# Altium schematic sheet sensor.schDoc: Sensor Controller
size A4; SheetNumber: 2; SheetTotal: 7
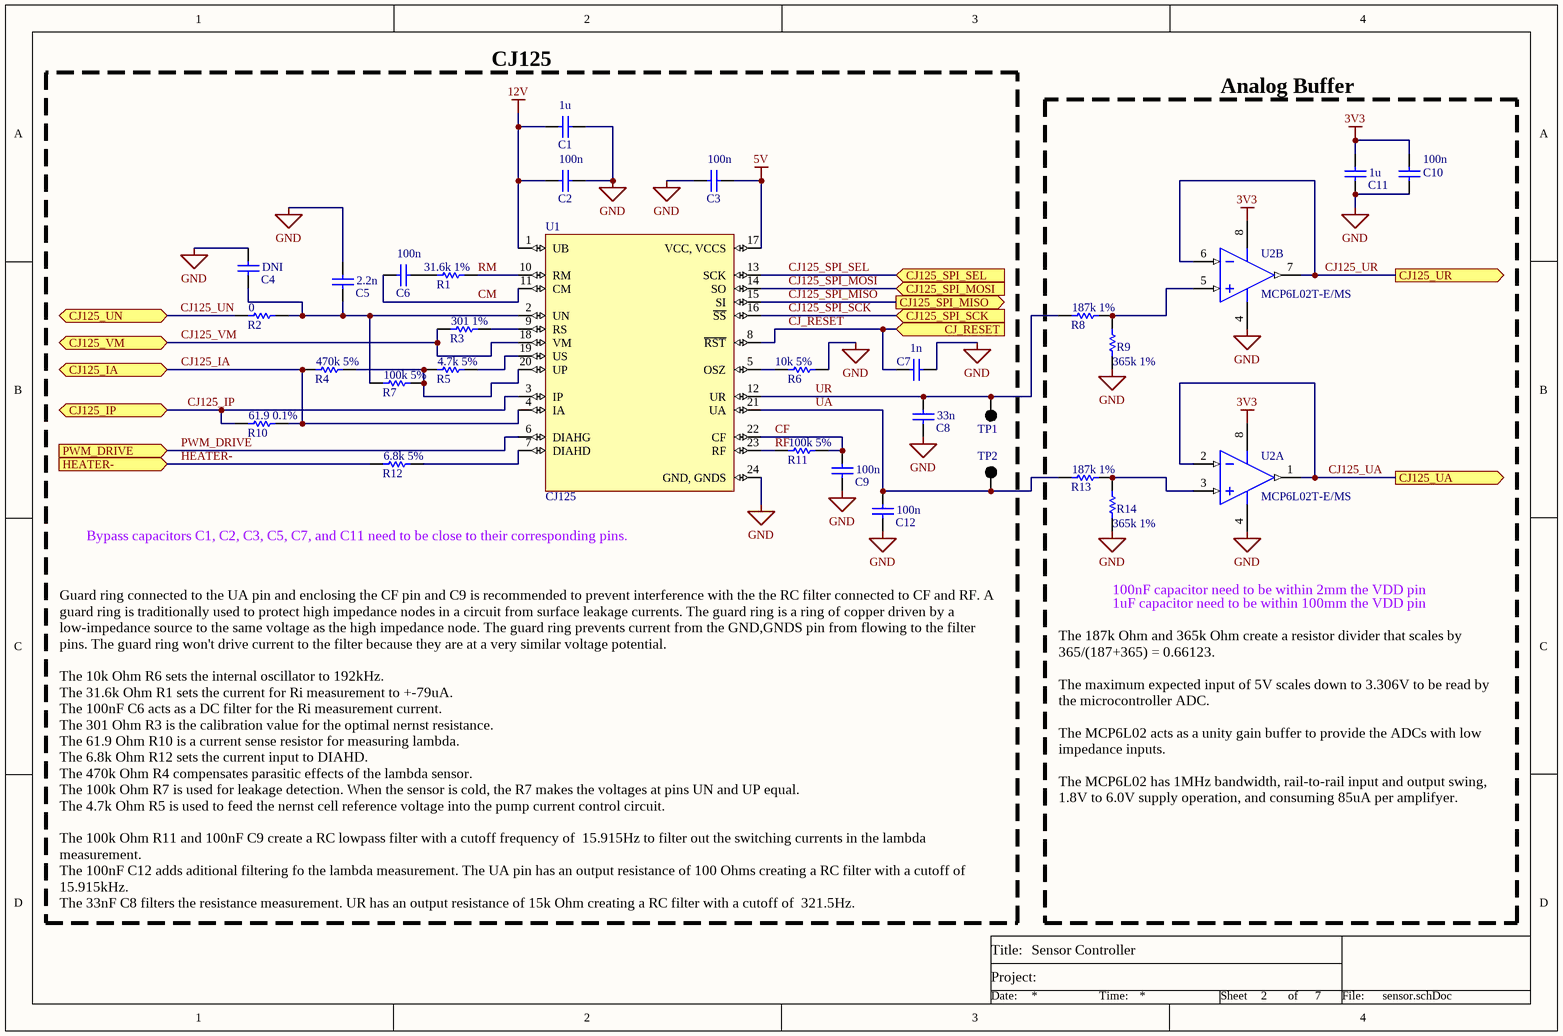
[diagram p0: sensor.schDoc]

## Parts
C1  value 1u  [0805]  (hidden comment: Generic 0805 Capacitor)
C2  value 100n  [0805]  (hidden comment: Generic 0805 Capacitor)
C3  value 100n  [0805]  (hidden comment: Generic 0805 Capacitor)
C4  value DNI  [0805]  (hidden comment: Generic 0805 Capacitor)
C5  value 2.2n  [0805]  (hidden comment: Generic 0805 Capacitor)
C6  value 100n  [0805]  (hidden comment: Generic 0805 Capacitor)
C7  value 1n  [0805]  (hidden comment: Generic 0805 Capacitor)
C8  value 33n  [0805]  (hidden comment: Generic 0805 Capacitor)
C9  value 100n  [0805]  (hidden comment: Generic 0805 Capacitor)
C10  value 100n  [0805]  (hidden comment: Generic 0805 Capacitor)
C11  value 1u  [1206]  (hidden comment: Generic 1206 Capacitor)
C12  value 100n  [0805]  (hidden comment: Generic 0805 Capacitor)
R1  value 31.6k 1%  [0603]  (hidden comment: Generic 0603 Resistor)
R2  value 0  [0603]  (hidden comment: Generic 0603 Resistor)
R3  value 301 1%  [0603]  (hidden comment: Generic 0603 Resistor)
R4  value 470k 5%  [0603]  (hidden comment: Generic 0603 Resistor)
R5  value 4.7k 5%  [0603]  (hidden comment: Generic 0603 Resistor)
R6  value 10k 5%  [0603]  (hidden comment: Generic 0603 Resistor)
R7  value 100k 5%  [0603]  (hidden comment: Generic 0603 Resistor)
R8  value 187k 1%  [0603]  (hidden comment: Generic 0603 Resistor)
R9  value 365k 1%  [0603]  (hidden comment: Generic 0603 Resistor)
R10  value 61.9 0.1%  [0603]  (hidden comment: Generic 0603 Resistor)
R11  value 100k 5%  [0603]  (hidden comment: Generic 0603 Resistor)
R12  value 6.8k 5%  [0603]  (hidden comment: Generic 0603 Resistor)
R13  value 187k 1%  [0603]  (hidden comment: Generic 0603 Resistor)
R14  value 365k 1%  [0603]  (hidden comment: Generic 0603 Resistor)
TP1  5001  [KSTN-5001]  (value not drawn)
TP2  5001  [KSTN-5001]  (value not drawn)
U1  CJ125  [SOIC-24]
U2  MCP6L02T-E/MS  [MSOP8_M]  (parts A,B of 2)

## Blocks framed on the sheet
CJ125: C1-C9 C12 R1-R7 R10-R12 TP1 TP2 U1
Analog Buffer: C10 C11 R8 R9 R13 R14 U2

## Ports
CJ125_IA (bidir), CJ125_IP (bidir), CJ125_SPI_MISO (out), CJ125_SPI_MOSI (in), CJ125_SPI_SCK (in), CJ125_SPI_SEL (in), CJ125_UA (out), CJ125_UN (bidir), CJ125_UR (out), CJ125_VM (bidir), CJ_RESET (in), HEATER- (in), PWM_DRIVE (in)

## Nets
3V3: C10.2 C11.2 U2.8(VDD)
5V: C3.1 U1.17(VCC,_VCCS)
12V: C1.1 C2.2 U1.1(UB)
GND: C1.2 C2.1 C3.2 C4.2 C5.2 C7.2 C8.1 C9.1 C10.1 C11.1 C12.1 R6.2 R9.1 R14.1 U1.24(GND,_GNDS) U2.4(VSS)
CF: C9.2 R11.2 U1.22(CF)
CJ125_IA: R4.1 R10.2 U1.4(IA) ; port CJ125_IA
CJ125_IP: R10.1 U1.3(IP) ; port CJ125_IP
CJ125_SPI_MISO: U1.15(SI) ; port CJ125_SPI_MISO
CJ125_SPI_MOSI: U1.14(SO) ; port CJ125_SPI_MOSI
CJ125_SPI_SCK: U1.16(~{SS}) ; port CJ125_SPI_SCK
CJ125_SPI_SEL: U1.13(SCK) ; port CJ125_SPI_SEL
CJ125_UA: U2.1(VOUTA) U2.2(VINA-) ; port CJ125_UA
CJ125_UN: R2.1 ; port CJ125_UN
CJ125_UR: U2.6(VINB-) U2.7(VOUTB) ; port CJ125_UR
CJ125_VM: R3.1 U1.18(VM) ; port CJ125_VM
CJ_RESET: C7.1 U1.8(~{RST}) ; port CJ_RESET
CM: C6.1 U1.11(CM)
HEATER-: R12.1 ; port HEATER-
PWM_DRIVE: U1.6(DIAHG) ; port PWM_DRIVE
RF: R11.1 U1.23(RF)
RM: R1.2 U1.10(RM)
UA: C12.2 R13.1 TP2.1 U1.21(UA)
UR: C8.2 R8.1 TP1.1 U1.12(UR)
NetC4_1: C4.1 C5.1 R2.2 R7.1 U1.2(UN)
NetC6_2: C6.2 R1.1
NetR3_2: R3.2 U1.9(RS)
NetR4_2: R4.2 R5.1 R7.2 U1.20(UP)
NetR5_2: R5.2 U1.19(US)
NetR6_1: R6.1 U1.5(OSZ)
NetR8_2: R8.2 R9.2 U2.5(VINB+)
NetR12_2: R12.2 U1.7(DIAHD)
NetR13_2: R13.2 R14.2 U2.3(VINA+)

## Notes on the sheet
- Bypass capacitors C1, C2, C3, C5, C7, and C11 need to be close to their corresponding pins.
- 100nF capacitor need to be within 2mm the VDD pin
- 1uF capacitor need to be within 100mm the VDD pin
- Guard ring connected to the UA pin and enclosing the CF pin and C9 is recommended to prevent interference with the the RC filter connected to CF and RF. A guard ring is traditionally used to protect high impedance nodes in a circuit from surface leakage currents. The guard ring is a ring of copper driven by a low-impedance source to the same voltage as the high impedance node. The guard ring prevents current from the GND,GNDS pin from flowing to the filter pins. The guard ring won't drive current to the filter because they are at a very similar voltage potential.
  The 10k Ohm R6 sets the internal oscillator to 192kHz.
  The 31.6k Ohm R1 sets the current for Ri measurement to +-79uA.
  The 100nF C6 acts as a DC filter for the Ri measurement current.
  The 301 Ohm R3 is the calibration value for the optimal nernst resistance.
  The 61.9 Ohm R10 is a current sense resistor for measuring lambda.
  The 6.8k Ohm R12 sets the current input to DIAHD.
  The 470k Ohm R4 compensates parasitic effects of the lambda sensor.
  The 100k Ohm R7 is used for leakage detection. When the sensor is cold, the R7 makes the voltages at pins UN and UP equal.
  The 4.7k Ohm R5 is used to feed the nernst cell reference voltage into the pump current control circuit.
  The 100k Ohm R11 and 100nF C9 create a RC lowpass filter with a cutoff frequency of  15.915Hz to filter out the switching currents in the lambda measurement.
  The 100nF C12 adds aditional filtering fo the lambda measurement. The UA pin has an output resistance of 100 Ohms creating a RC filter with a cutoff of 15.915kHz.
  The 33nF C8 filters the resistance measurement. UR has an output resistance of 15k Ohm creating a RC filter with a cutoff of  321.5Hz.
- The 187k Ohm and 365k Ohm create a resistor divider that scales by 365/(187+365) = 0.66123.
  The maximum expected input of 5V scales down to 3.306V to be read by the microcontroller ADC.
  The MCP6L02 acts as a unity gain buffer to provide the ADCs with low impedance inputs.
  The MCP6L02 has 1MHz bandwidth, rail-to-rail input and output swing, 1.8V to 6.0V supply operation, and consuming 85uA per amplifyer.
- Title:
- Project:
- Date:
- Time:
- Sheet
- of
- File:
- Title
- Size:
- E
- Number:
- Revision:

## Library data of the parts
C1-C10 C12 = C_0805: Specifications: *
C11 = C_1206: Specifications: *
R1-R14 = R_0603: Specifications: *
TP1 TP2 = TP5001: Test Point, Black, 1-Pin THD, RoHS, Bulk; Manufacturer: Keystone; Other Names: 5001K; Catalog Drawings: 5000Series; Alternate Color: 5004K-ND / -TESTPOINTPCMINI.040"DYELLOW / 5003K-ND / -TESTPOINTPCMINI.040"DORANGE / 5002K-ND / -TESTPOINTPCMINI.040"DWHITE / 5000K-ND / -TESTPOINTPCMINI.040"DRED; Kits: DKTGRS232C-KIT-ND / -TTLCONVERTER; Online Catalog: ColorCodedTestPoints; Datasheet URL: https://ciiva.com/datasheet-click-2917627?src=ciiva&sig=bd195616; Mounting Type: 0.040"(1.02mm)HoleDiameter; Family: TestPoints; RoHS Information: RoHSComplianceStatement; Datasheet Version: Rev. G, 12/2008; Color: Black; Category: TestandMeasurement; Standard Package: 100; Manufacturer URL: http://www.keyelco.com/; Material: Base,Nylon46,UL94V-0; Type: PCTestPoint,Miniature; Terminal: 0.010"x0.020"(0.25mmx0.51mm)PhosphorBronzeWire,SilverPlated; Series: THM; Packaging: Bulk
U1 = CJ125: 5V 2Mbaud SMT Lambda Probe Interface IC - SOIC-24; Supplier 1: Future Electronics; Package Reference: SOIC-24; Supplier Part Number 1: 0272240104
U2 = MCP6L02: 1 MHz, 85 Î¼A Dual Op Amp, 8-Pin MSOP, Extended Temperature Range, Tape and Reel; ComponentLink2URL: http://ww1.microchip.com/downloads/en/DeviceDoc/22140b.pdf; PackageDescription: 8-Lead Plastic Micro Small Outline Package (MS) [MSOP]; ComponentLink1URL: http://www.microchip.com/; ComponentLink1Description: Manufacturer URL; RevisionNote: URLs added. DatasheetVersion updated.; PackageVersion: revBB, Aug-2009; ComponentLink3URL: http://www.microchip.com/stellent/groups/techpub_sg/documents/packagingspec/en012702.pdf; ComponentLink2Description: Datasheet; ComponentLink3Description: Package Specification; DatasheetVersion: revB, Sep-2011; PackageReference: MSOP-MS8